# Altium schematic sheet GTM_Connectors.SchDoc: GTM Scheme
size A4; CompanyName: Koło Naukowe Robotyków; DrawnBy: Tadeusz Golczyk; Address1: Nowowiejska 24; Address2: 00-001; Address3: Warszawa; DocumentNumber: 1
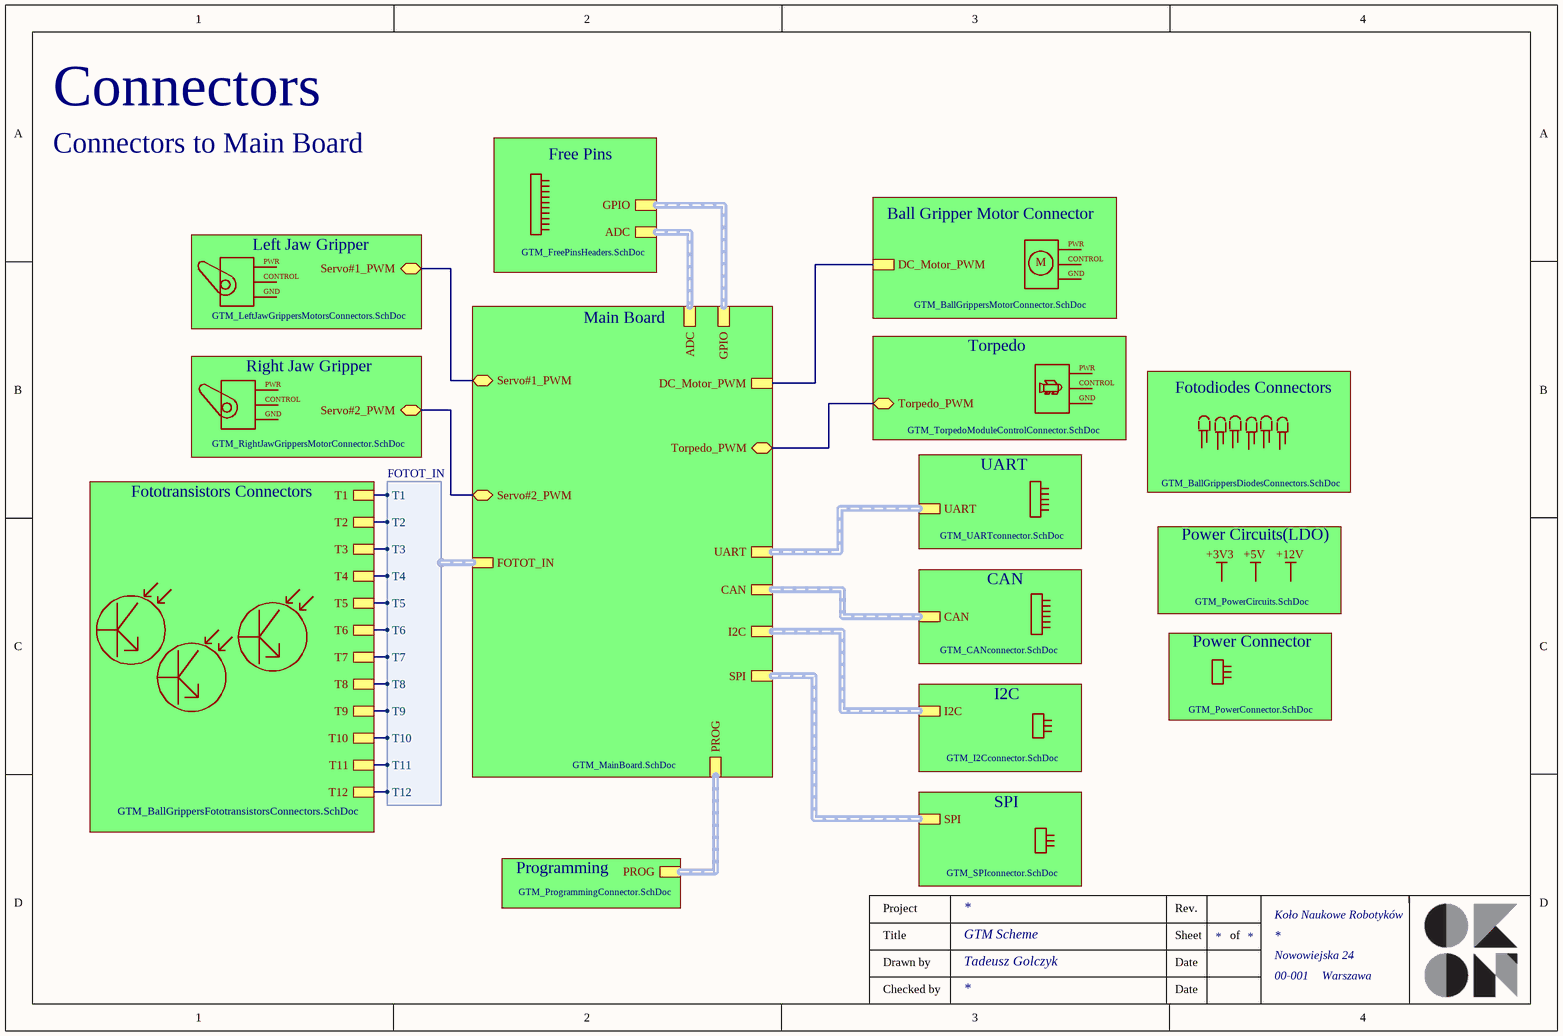
[diagram p0: GTM_Connectors.SchDoc]

## Sub-sheets
Ball Gripper Motor Connector = GTM_BallGrippersMotorConnector.SchDoc: DC_Motor_PWM
CAN = GTM_CANconnector.SchDoc: CAN
Fotodiodes Connectors = GTM_BallGrippersDiodesConnectors.SchDoc: no entries
Fototransistors Connectors = GTM_BallGrippersFototransistorsConnectors.SchDoc: T1, T2, T3, T4, T5, T6, T7, T8, T9, T10, T11, T12
Free Pins = GTM_FreePinsHeaders.SchDoc: ADC, GPIO
I2C = GTM_I2Cconnector.SchDoc: I2C
Left Jaw Gripper = GTM_LeftJawGrippersMotorsConnectors.SchDoc: Servo#1_PWM (bidir)
Main Board = GTM_MainBoard.SchDoc: FOTOT_IN (harness FOTOT_IN), Servo#2_PWM (bidir), Servo#1_PWM (bidir), ADC, GPIO, PROG, DC_Motor_PWM, Torpedo_PWM (bidir), UART, CAN, I2C, SPI
Power Circuits(LDO) = GTM_PowerCircuits.SchDoc: no entries
Power Connector = GTM_PowerConnector.SchDoc: no entries
Programming = GTM_ProgrammingConnector.SchDoc: PROG
Right Jaw Gripper = GTM_RightJawGrippersMotorConnector.SchDoc: Servo#2_PWM (bidir)
SPI = GTM_SPIconnector.SchDoc: SPI
Torpedo = GTM_TorpedoModuleControlConnector.SchDoc: Torpedo_PWM (bidir)
UART = GTM_UARTconnector.SchDoc: UART

## Harnesses
FOTOT_IN: T1, T2, T3, T4, T5, T6, T7, T8, T9, T10, T11, T12

## Nets
(unnamed): sheet Main Board/Servo#2_PWM, sheet Right Jaw Gripper/Servo#2_PWM
(unnamed): sheet Main Board/Servo#1_PWM, sheet Left Jaw Gripper/Servo#1_PWM
(unnamed): sheet Main Board/DC_Motor_PWM, sheet Ball Gripper Motor Connector/DC_Motor_PWM
(unnamed): sheet Main Board/Torpedo_PWM, sheet Torpedo/Torpedo_PWM
(unnamed): sheet Fototransistors Connectors/T1, sheet Main Board/FOTOT_IN.T1
(unnamed): sheet Fototransistors Connectors/T2, sheet Main Board/FOTOT_IN.T2
(unnamed): sheet Fototransistors Connectors/T3, sheet Main Board/FOTOT_IN.T3
(unnamed): sheet Fototransistors Connectors/T4, sheet Main Board/FOTOT_IN.T4
(unnamed): sheet Fototransistors Connectors/T5, sheet Main Board/FOTOT_IN.T5
(unnamed): sheet Fototransistors Connectors/T6, sheet Main Board/FOTOT_IN.T6
(unnamed): sheet Fototransistors Connectors/T7, sheet Main Board/FOTOT_IN.T7
(unnamed): sheet Fototransistors Connectors/T8, sheet Main Board/FOTOT_IN.T8
(unnamed): sheet Fototransistors Connectors/T9, sheet Main Board/FOTOT_IN.T9
(unnamed): sheet Fototransistors Connectors/T10, sheet Main Board/FOTOT_IN.T10
(unnamed): sheet Fototransistors Connectors/T11, sheet Main Board/FOTOT_IN.T11
(unnamed): sheet Fototransistors Connectors/T12, sheet Main Board/FOTOT_IN.T12

## Buses and harness runs
harness sheet CAN/CAN = sheet Main Board/CAN
harness sheet Free Pins/ADC = sheet Main Board/ADC
harness sheet Free Pins/GPIO = sheet Main Board/GPIO
harness sheet I2C/I2C = sheet Main Board/I2C
harness sheet Main Board/PROG = sheet Programming/PROG
harness sheet Main Board/SPI = sheet SPI/SPI
harness sheet Main Board/UART = sheet UART/UART

## Notes on the sheet
- Connectors
- Connectors to Main Board
- PWR
- CONTROL
- GND
- M
- +3V3
- +5V
- +12V
- Project
- Rev.
- Title
- Drawn by
- Date
- Sheet
- of
- Checked by